# Altium schematic sheet Sheet1.SchDoc
size A4
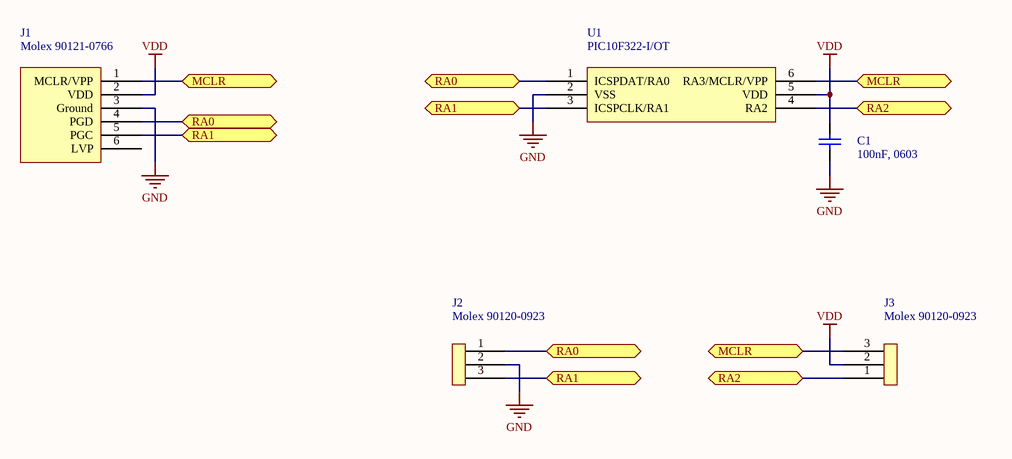
[diagram p0: Sheet1.SchDoc]

## Parts
C1  100nF, 0603  [Capacitor 0603]
J1  Molex 90121-0766  [Molex 90121-0766]
J2  Molex 90120-0923  [Molex 90120-0923]
J3  Molex 90120-0923  [Molex 90120-0923]
U1  PIC10F322-I/OT  [SOT-23-6]

## Ports
MCLR, RA0, RA1, RA2

## Nets
GND: C1.1 J1.3(Ground) J2.2 U1.2(VSS)
VDD: C1.2 J1.2(VDD) J3.2 U1.5(VDD)
MCLR: J1.1(MCLR/VPP) J3.3 U1.6(RA3/MCLR/VPP) ; port MCLR
RA0: J1.4(PGD) J2.1 U1.1(ICSPDAT/RA0) ; port RA0
RA1: J1.5(PGC) J2.3 U1.3(ICSPCLK/RA1) ; port RA1
RA2: J3.1 U1.4(RA2) ; port RA2

Not connected (* = marked no-connect by the designer): J1 6(LVP)

## Library data of the parts
C1 = Capacitor
J1 = MPLAB ICSP